# Altium schematic sheet FPGA.SchDoc: FPGA
size A3; DocumentNumber: 10; Revision: 1.8.2; SheetNumber: 10; SheetTotal: 19
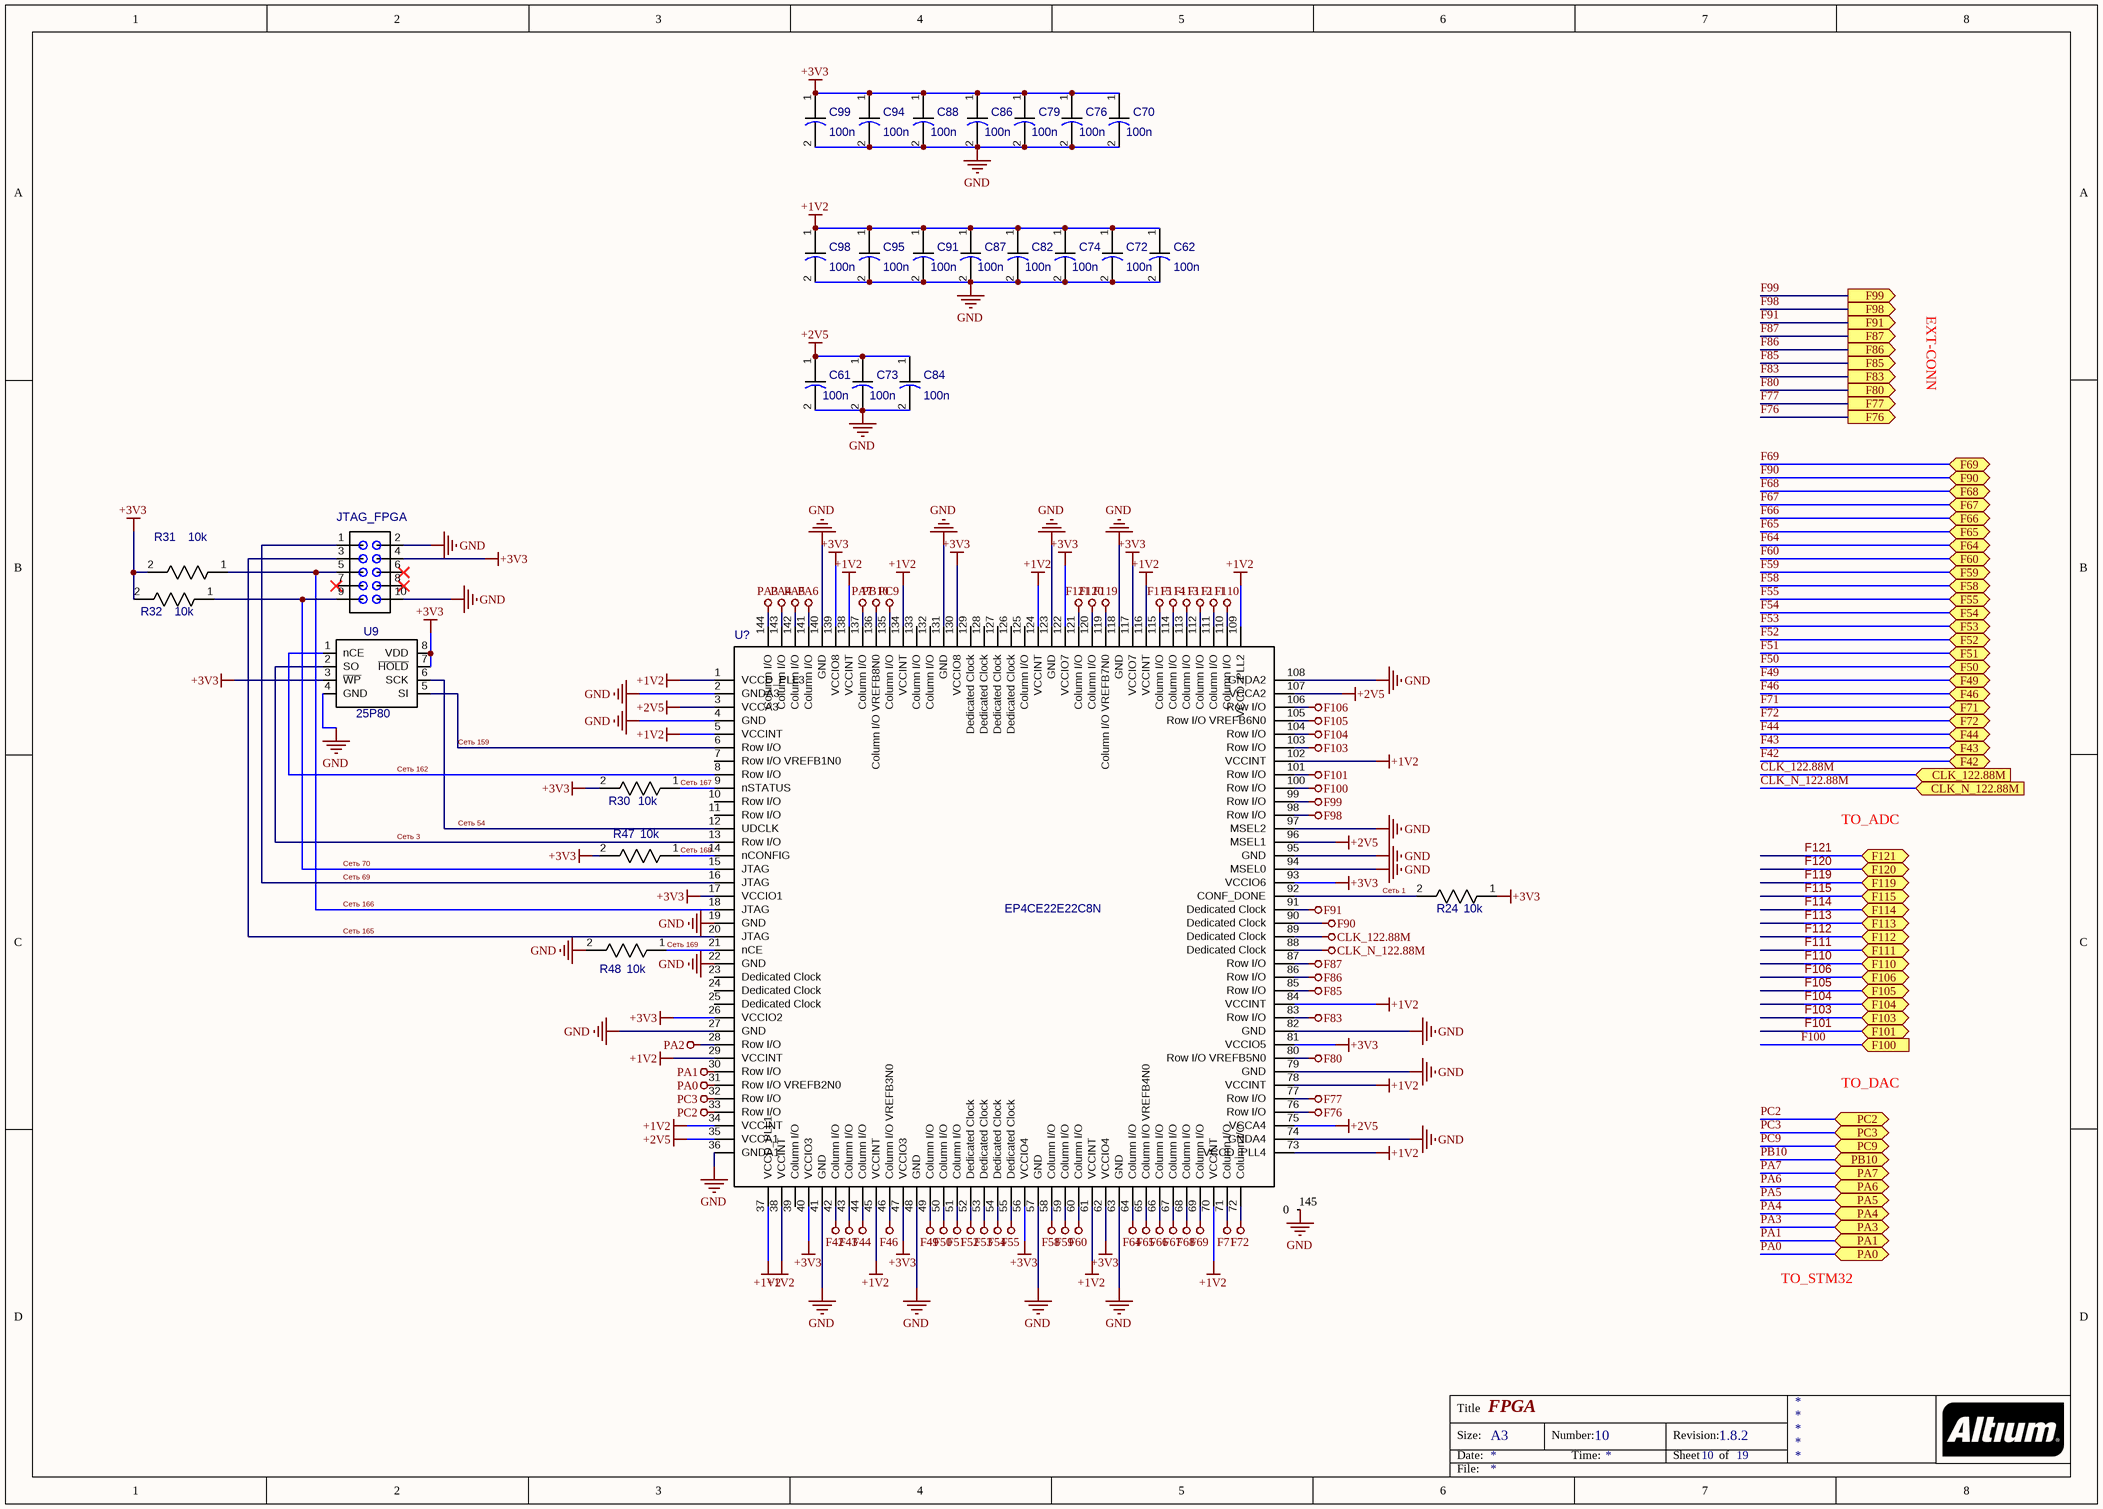
[diagram p0: FPGA.SchDoc]

## Parts
C61  100n  [CAP_0805]
C62  100n  [CAP_0805]
C70  100n  [CAP_0805]
C72  100n  [CAP_0805]
C73  100n  [CAP_0805]
C74  100n  [CAP_0805]
C76  100n  [CAP_0805]
C79  100n  [CAP_0805]
C82  100n  [CAP_0805]
C84  100n  [CAP_0805]
C86  100n  [CAP_0805]
C87  100n  [CAP_0805]
C88  100n  [CAP_0805]
C91  100n  [CAP_0805]
C94  100n  [CAP_0805]
C95  100n  [CAP_0805]
C98  100n  [CAP_0805]
C99  100n  [CAP_0805]
JTAG_FPGA  (no value)  [IDC10]
R24  10k  [RES_0805]
R30  10k  [RES_0805]
R31  10k  [RES_0805]
R32  10k  [RES_0805]
R47  10k  [RES_0805]
R48  10k  [RES_0805]
U9  25P80  [25P80]
U?  EP4CE22E22C8N  [EP4CE22E22C8N]

## Ports
CLK_122.88M (in), CLK_N_122.88M (in), F42 (bidir), F43 (bidir), F44 (bidir), F46 (bidir), F49 (bidir), F50 (bidir), F51 (bidir), F52 (bidir), F53 (bidir), F54 (bidir), F55 (bidir), F58 (bidir), F59 (bidir), F60 (bidir), F64 (bidir), F65 (bidir), F66 (bidir), F67 (bidir), F68 (bidir), F69 (bidir), F71 (bidir), F72 (bidir), F76 (out), F77 (out), F80 (out), F83 (out), F85 (out), F86 (out), F87 (out), F90 (bidir), F91 (out), F98 (out), F99 (out), F100 (in), F101 (bidir), F103 (bidir), F104 (bidir), F105 (bidir), F106 (bidir), F110 (bidir), F111 (bidir), F112 (bidir), F113 (bidir), F114 (bidir), F115 (bidir), F119 (bidir), F120 (bidir), F121 (bidir), PA0 (bidir), PA1 (bidir), PA3 (bidir), PA4 (bidir), PA5 (bidir), PA6 (bidir), PA7 (bidir), PB10 (bidir), PC2 (bidir), PC3 (bidir), PC9 (bidir)

## Nets
+1V2: C62.1 C72.1 C74.1 C82.1 C87.1 C91.1 C95.1 C98.1 U?.1(VCCD_PLL3) U?.5(VCCINT) U?.29(VCCINT) U?.34(VCCINT) U?.37(VCCD_PLL1) U?.38(VCCINT) U?.45(VCCINT) U?.61(VCCINT) U?.70(VCCINT) U?.73(VCCD_PLL4) U?.78(VCCINT) U?.84(VCCINT) U?.102(VCCINT) U?.109(VCCD_PLL2) U?.116(VCCINT) U?.124(VCCINT) U?.134(VCCINT) U?.138(VCCINT)
+2V5: C61.1 C73.1 C84.1 U?.3(VCCA3) U?.35(VCCA1) U?.75(VCCA4) U?.96(MSEL1) U?.107(VCCA2)
+3V3: C70.1 C76.1 C79.1 C86.1 C88.1 C94.1 C99.1 JTAG_FPGA.4 R24.1 R30.2 R31.2 R32.2 R47.2 U9.3(~{WP}) U9.7(~{HOLD}) U9.8(VDD) U?.17(VCCIO1) U?.26(VCCIO2) U?.40(VCCIO3) U?.47(VCCIO3) U?.56(VCCIO4) U?.62(VCCIO4) U?.81(VCCIO5) U?.93(VCCIO6) U?.117(VCCIO7) U?.122(VCCIO7) U?.130(VCCIO8) U?.139(VCCIO8)
CLK_122.88M: U?.89(Dedicated_Clock) ; port CLK_122.88M
CLK_N_122.88M: U?.88(Dedicated_Clock) ; port CLK_N_122.88M
F42: U?.42(Column_I/O) ; port F42
F43: U?.43(Column_I/O) ; port F43
F44: U?.44(Column_I/O) ; port F44
F46: U?.46(Column_I/O_VREFB3N0) ; port F46
F49: U?.49(Column_I/O) ; port F49
F50: U?.50(Column_I/O) ; port F50
F51: U?.51(Column_I/O) ; port F51
F52: U?.52(Dedicated_Clock) ; port F52
F53: U?.53(Dedicated_Clock) ; port F53
F54: U?.54(Dedicated_Clock) ; port F54
F55: U?.55(Dedicated_Clock) ; port F55
F58: U?.58(Column_I/O) ; port F58
F59: U?.59(Column_I/O) ; port F59
F60: U?.60(Column_I/O) ; port F60
F64: U?.64(Column_I/O) ; port F64
F65: U?.65(Column_I/O_VREFB4N0) ; port F65
F66: U?.66(Column_I/O) ; port F66
F67: U?.67(Column_I/O) ; port F67
F68: U?.68(Column_I/O) ; port F68
F69: U?.69(Column_I/O) ; port F69
F71: U?.71(Column_I/O) ; port F71
F72: U?.72(Column_I/O) ; port F72
F76: U?.76(Row_I/O) ; port F76
F77: U?.77(Row_I/O) ; port F77
F80: U?.80(Row_I/O_VREFB5N0) ; port F80
F83: U?.83(Row_I/O) ; port F83
F85: U?.85(Row_I/O) ; port F85
F86: U?.86(Row_I/O) ; port F86
F87: U?.87(Row_I/O) ; port F87
F90: U?.90(Dedicated_Clock) ; port F90
F91: U?.91(Dedicated_Clock) ; port F91
F98: U?.98(Row_I/O) ; port F98
F99: U?.99(Row_I/O) ; port F99
F100: U?.100(Row_I/O) ; port F100
F101: U?.101(Row_I/O) ; port F101
F103: U?.103(Row_I/O)
F104: U?.104(Row_I/O) ; port F104
F105: U?.105(Row_I/O_VREFB6N0) ; port F105
F106: U?.106(Row_I/O) ; port F106
F110: U?.110(Column_I/O) ; port F110
F111: U?.111(Column_I/O) ; port F111
F112: U?.112(Column_I/O)
F113: U?.113(Column_I/O) ; port F113
F114: U?.114(Column_I/O) ; port F114
F115: U?.115(Column_I/O) ; port F115
F119: U?.119(Column_I/O_VREFB7N0) ; port F119
F120: U?.120(Column_I/O) ; port F120
F121: U?.121(Column_I/O) ; port F121
GND: C61.2 C62.2 C70.2 C72.2 C73.2 C74.2 C76.2 C79.2 C82.2 C84.2 C86.2 C87.2 C88.2 C91.2 C94.2 C95.2 C98.2 C99.2 JTAG_FPGA.2 JTAG_FPGA.10 R48.2 U9.4(GND) U?.2(GNDA3) U?.4(GND) U?.19(GND) U?.22(GND) U?.27(GND) U?.36(GNDA1) U?.41(GND) U?.48(GND) U?.57(GND) U?.63(GND) U?.74(GNDA4) U?.79(GND) U?.82(GND) U?.94(MSEL0) U?.95(GND) U?.97(MSEL2) U?.108(GNDA2) U?.118(GND) U?.123(GND) U?.131(GND) U?.140(GND) U?.145(0)
PA0: U?.31(Row_I/O_VREFB2N0) ; port PA0
PA1: U?.30(Row_I/O) ; port PA1
PA2: U?.28(Row_I/O)
PA3: U?.144(Column_I/O) ; port PA3
PA4: U?.143(Column_I/O) ; port PA4
PA5: U?.142(Column_I/O) ; port PA5
PA6: U?.141(Column_I/O) ; port PA6
PA7: U?.137(Column_I/O) ; port PA7
PB10: U?.136(Column_I/O_VREFB8N0) ; port PB10
PC2: U?.33(Row_I/O) ; port PC2
PC3: U?.32(Row_I/O) ; port PC3
PC9: U?.135(Column_I/O) ; port PC9
Сеть 1: R24.2 U?.92(CONF_DONE)
Сеть 3: U9.2(SO) U?.13(Row_I/O)
Сеть 54: U9.6(SCK) U?.12(UDCLK)
Сеть 69: JTAG_FPGA.1 U?.16(JTAG)
Сеть 70: JTAG_FPGA.9 R32.1 U?.15(JTAG)
Сеть 159: U9.5(SI) U?.6(Row_I/O)
Сеть 162: U9.1(nCE) U?.8(Row_I/O)
Сеть 165: JTAG_FPGA.3 U?.20(JTAG)
Сеть 166: JTAG_FPGA.5 R31.1 U?.18(JTAG)
Сеть 167: R30.1 U?.9(nSTATUS)
Сеть 168: R47.1 U?.14(nCONFIG)
Сеть 169: R48.1 U?.21(nCE)

Not connected (* = marked no-connect by the designer): JTAG_FPGA 6* 7* 8*; U? 7(Row_I/O_VREFB1N0) 10(Row_I/O) 11(Row_I/O) 23(Dedicated_Clock) 24(Dedicated_Clock) 25(Dedicated_Clock) 39(Column_I/O) 125(Column_I/O) 126(Dedicated_Clock) 127(Dedicated_Clock) 128(Dedicated_Clock) 129(Dedicated_Clock) 132(Column_I/O) 133(Column_I/O)

## Notes on the sheet
- EXT-CONN
- TO_ADC
- TO_DAC
- TO_STM32
- Title
- Size:
- Date:
- A3
- Number:
- Time:
- Revision:
- Sheet
- of
- File:

## Library data of the parts
C61 C62 C70 C72-C74 C76 C79 C82 C84 C86-C88 C91 C94 C95 C98 C99 = CAP_0805: Value: 100n
JTAG_FPGA = IDC10
R24 R30-R32 R47 R48 = RES_0805: Value: 10k
U9 = 25P80: Value: 25P80
U? = EP4CE22E22C8N: Value: EP4CE22E22C8N